# Altium project Ngu-nghiep.prjpcb
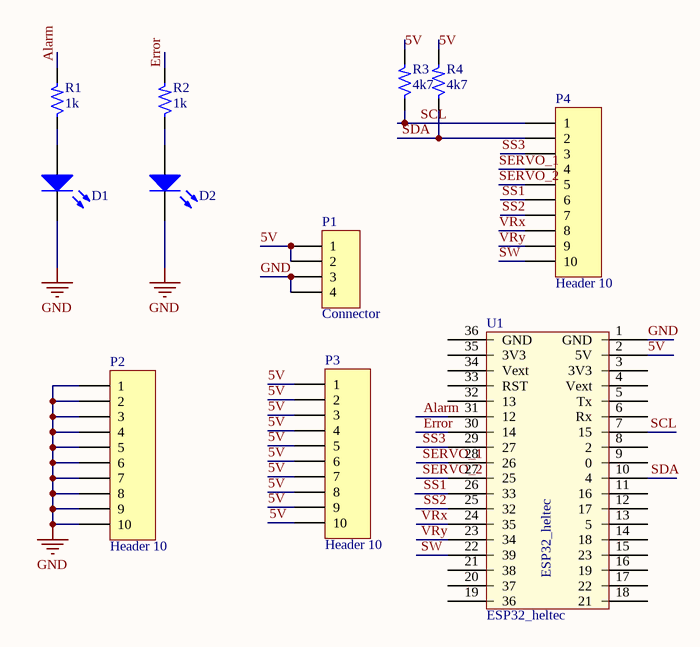
[diagram p0: Ngu-nghiep.schdoc]
1 sheet, 11 parts. Net scope: global (net labels, ports and power ports of the same name join across sheets).
Board file: ngu-nghiep.pcbdoc

## Sheet Ngu-nghiep.schdoc
size A

### Parts
D1  LED  [LED_3mm]  (value not drawn)
D2  LED  [LED_3mm]  (value not drawn)
P1  Connector  [JST-XH_B4B-XH-A]
P2  Header 10  [HDR1X10]
P3  Header 10  [HDR1X10]
P4  Header 10  [HDR1X10]
R1  1k  [R1/8W]
R2  1k  [R1/8W]
R3  4k7  [R1/8W]
R4  4k7  [R1/8W]
U1  ESP32_heltec  [ESP32_WFK_Heltec]

### Nets
GND: D1.2(K) D2.2(K) P1.3 P1.4 P2.1 P2.2 P2.3 P2.4 P2.5 P2.6 P2.7 P2.8 P2.9 P2.10 U1.1(GND)
5V: P1.1 P1.2 P3.1 P3.2 P3.3 P3.4 P3.5 P3.6 P3.7 P3.8 P3.9 P3.10 R3.2 R4.2 U1.2(5V)
Alarm: R1.2 U1.31(12)
Error: R2.2 U1.30(14)
SCL: P4.1 R3.1 U1.7(15)
SDA: P4.2 R4.1 U1.10(4)
SERVO_1: P4.4 U1.28(26)
SERVO_2: P4.5 U1.27(25)
SS1: P4.6 U1.26(33)
SS2: P4.7 U1.25(32)
SS3: P4.3 U1.29(27)
SW: P4.10 U1.22(39)
VRx: P4.8 U1.24(35)
VRy: P4.9 U1.23(34)
NetD1_1: D1.1(A) R1.1
NetD2_1: D2.1(A) R2.1

Not connected (* = marked no-connect by the designer): U1 3(3V3) 4(Vext) 5(Tx) 6(Rx) 8(2) 9(0) 11(16) 12(17) 13(5) 14(18) 15(23) 16(19) 17(22) 18(21) 19(36) 20(37) 21(38) 32(13) 33(RST) 34(Vext) 35(3V3) 36(GND)

### Library data of the parts
D1 D2 = LED: Typical INFRARED GaAs LED; Published: 8-Jun-2000; LatestRevisionDate: 08-Jul-2005; LatestRevisionNote: Mech Layer 1 removed.; PackageReference: LED-0; Publisher: Altium Limited
P1 = Connector_4pin
P2-P4 = Header 10: Header, 10-Pin; LatestRevisionDate: 17-Jul-2002; LatestRevisionNote: Re-released for DXP Platform.; Publisher: Altium Limited
R1-R4 = R: Resistor 1/4W; Value: R1/4W - 1K
U1 = ESP32_heltec: ESP32 IOT kit